# EAGLE design Single (EAGLE 7.7.0)
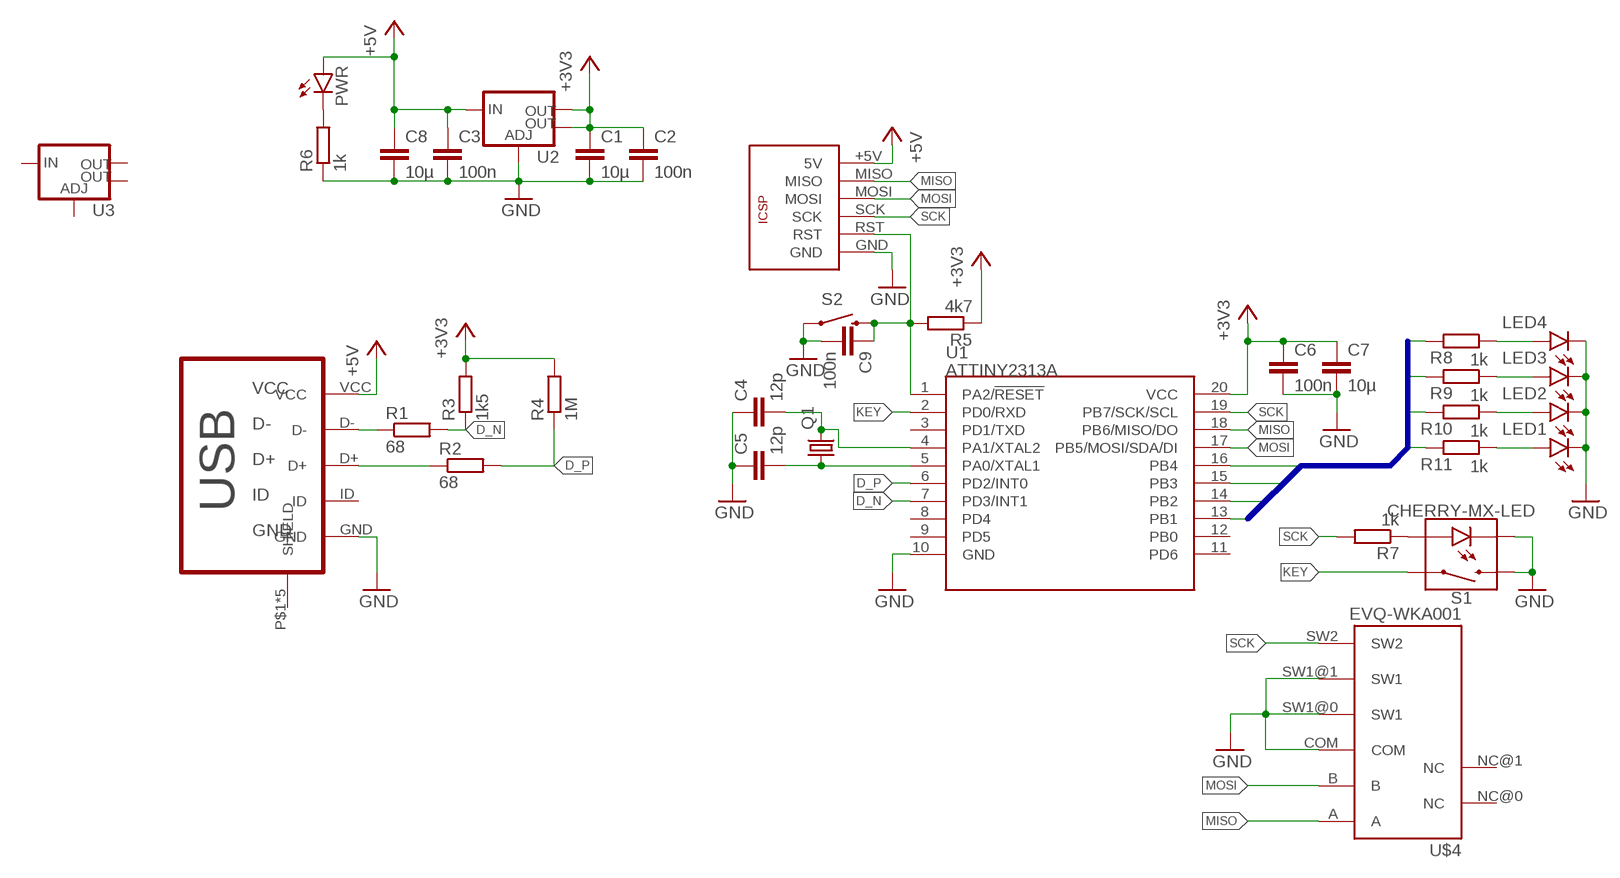
[diagram p0: schematic, sheet 1]

## Parts
C1  10µ  C-EUC0603  [C0603]
C2  100n  C-EUC0603  [C0603]
C3  100n  C-EUC0603  [C0603]
C4  12p  C-EUC0603  [C0603]
C5  12p  C-EUC0603  [C0603]
C6  100n  C-EUC0603  [C0603]
C7  10µ  C-EUC0603  [C0603]
C8  10µ  C-EUC0603  [C0603]
C9  100n  C-EUC0603  [C0603]
LED1  LED0603  [LED-0603]
LED2  LED0603  [LED-0603]
LED3  LED0603  [LED-0603]
LED4  LED0603  [LED-0603]
PWR  LED0603  [LED-0603]
Q1  CRYSTALCTS406  [CTS406]
R1  68  R-EU_R0603  [R0603]
R2  68  R-EU_R0603  [R0603]
R3  1k5  R-EU_R0603  [R0603]
R4  1M  R-EU_R0603  [R0603]
R5  4k7  R-EU_R0603  [R0603]
R6  1k  R-EU_R0603  [R0603]
R7  1k  R-EU_R0603  [R0603]
R8  1k  R-EU_R0603  [R0603]
R9  1k  R-EU_R0603  [R0603]
R10  1k  R-EU_R0603  [R0603]
R11  1k  R-EU_R0603  [R0603]
S1  CHERRY-MX-LED  [CHERRY-MX-LED]
S2  SWITCH-MOMENTARY-2SMD-1101NE  [TACTILE-SWITCH-1101NE]
U1  ATTINY2313A  [SOP20W]
U2  V_REG_LM1117SOT223  [SOT223]
U3  V_REG_LM1117SOT223  [SOT223]
U$1  ICSPTHROUGHHOLE  [ICSP-THROUGHHOLE]
U$2  MICRO-USB-B  [MICRO_USB_4_LEGS]
U$4  EVQ-WKA001  [EVQ-WKA001]

## Nets
+3V3: C1.1 C2.1 C6.1 C7.1 R3.2 R4.2 R5.1 U1.20(VCC) U2.2(OUT) U2.4(OUT)
+5V: C3.1 C8.1 PWR.A U2.3(IN) U$1.+5V(5V) U$2.VCC
D_N: R1.2 R3.1 U1.7(PD3/INT1)
D_P: R2.2 R4.1 U1.6(PD2/INT0)
DUSB_N: R1.1 U$2.D-
DUSB_P: R2.1 U$2.D+
GND: C1.2 C2.2 C3.2 C4.1 C5.1 C6.2 C7.2 C8.2 C9.2 LED1.C LED2.C LED3.C LED4.C R6.1 S1.K(C) S1.S2 S2.1 U1.10(GND) U2.1(ADJ) U$1.GND U$2.GND U$4.COM U$4.SW1@0(SW1) U$4.SW1@1(SW1)
KEY: S1.S1 U1.2(PD0/RXD)
LED1: R11.2 U1.13(PB1)
LED2: R10.2 U1.14(PB2)
LED3: R9.2 U1.15(PB3)
LED4: R8.2 U1.16(PB4)
MISO: U1.18(PB6/MISO/DO) U$1.MISO U$4.A
MOSI: U1.17(PB5/MOSI/SDA/DI) U$1.MOSI U$4.B
N$1: C4.2 Q1.3 U1.4(PA1/XTAL2)
N$2: C5.2 Q1.1 U1.5(PA0/XTAL1)
N$3: PWR.C R6.2
N$6: C9.1 R5.2 S2.2 U1.1(PA2/!RESET) U$1.RST
N$7: R7.1 S1.A
N$10: LED4.A R8.1
N$11: LED3.A R9.1
N$12: LED2.A R10.1
N$13: LED1.A R11.1
SCK: R7.2 U1.19(PB7/SCK/SCL) U$1.SCK U$4.SW2
Unconnected: U1.3(PD1/TXD) U1.8(PD4) U1.9(PD5) U1.11(PD6) U1.12(PB0) U3.1(ADJ) U3.2(OUT) U3.3(IN) U3.4(OUT) U$2.ID U$2.P$1(SHIELD) U$2.P$2(SHIELD) U$2.P$3(SHIELD) U$2.P$4(SHIELD) U$2.P$5(SHIELD) U$4.NC@0(NC) U$4.NC@1(NC)

## Buses
LED1,LED2,LED3,LED4

## Library data of the parts
C1-C9 = rcl:C-EU: CAPACITOR, European symbol
LED1-LED4 PWR = SparkFun-LED:LED: LEDs Standard schematic elements and footprints for 5mm, 3mm, 1206, and 0603 sized LEDs. 5mm - Spark Fun Electronics SKU : COM-00529 (and others)
Q1 = crystal:CRYSTAL: CRYSTAL; OC_FARNELL: unknown; OC_NEWARK: unknown
R1-R11 = rcl:R-EU_: RESISTOR, European symbol
S1 = SparkFun-Electromechanical:CHERRY-MX-LED: Cherry MX Switch - Electromechanical Swith w/ LED Cherry MX Keyswitches are top-of-the-line mechanical keyboard switches. They’re satisfyingly “clicky”, reliable up to tens-of-millions of key presses, and a standard in gaming and programming keyboards across the globe. This ‘blue’ version Cherry MX Switch is favored by most due to its secondary internal actuator making it less likely to “double-tap.” If you are looking for a noticeably audible and high-quality key switch, this is the perfect option for you! SparkFun Product Link <https://www.sparkfun.com/products/13834>; SF_ID: COM-13834
S2 = SparkFun-Electromechanical:SWITCH-MOMENTARY-2: Various NO switches- pushbuttons, reed, etc; PROD_ID: SWCH-00815
U1 = SparkFun-DigitalIC:ATTINY2313A: ATTINY2313A 2kB 20MHz I2C/SPI/UART; PROD_ID: IC-11305
U2 U3 = SparkFun-PowerIC:V_REG_LM1117: Voltage Regulator LM1117 Standard adjustable voltage regulator but in SMD form. Spark Fun Electronics SKU : COM-00595; PROD_ID: VREG-08170
U$1 = OwnStuff:ICSP
U$2 = micro usb B - 4LEGS:MICRO-USB-B
U$4 = EVQ-WKA001:EVQ-WKA001

## Board
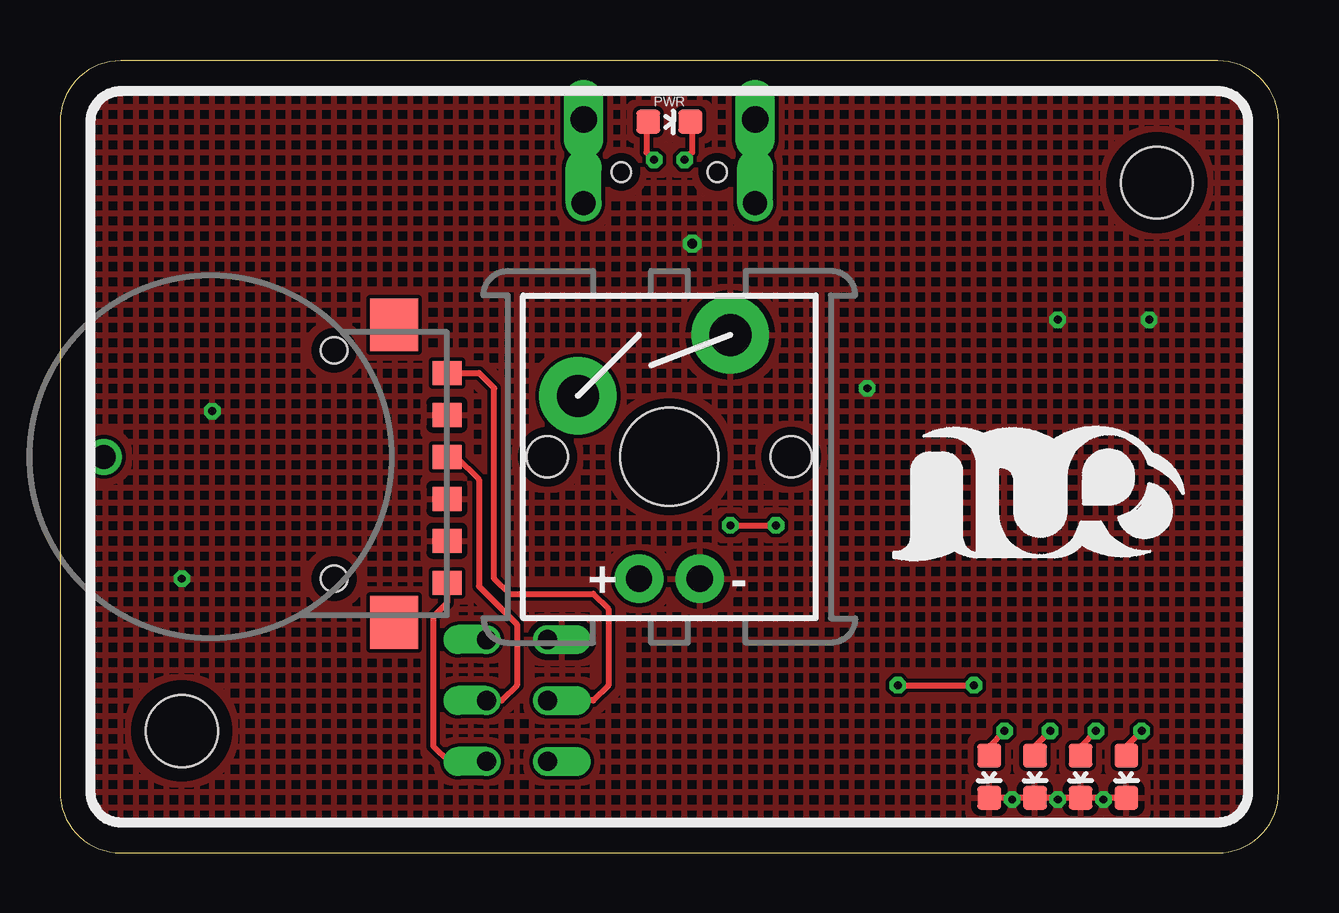
[diagram p1: board, top side]
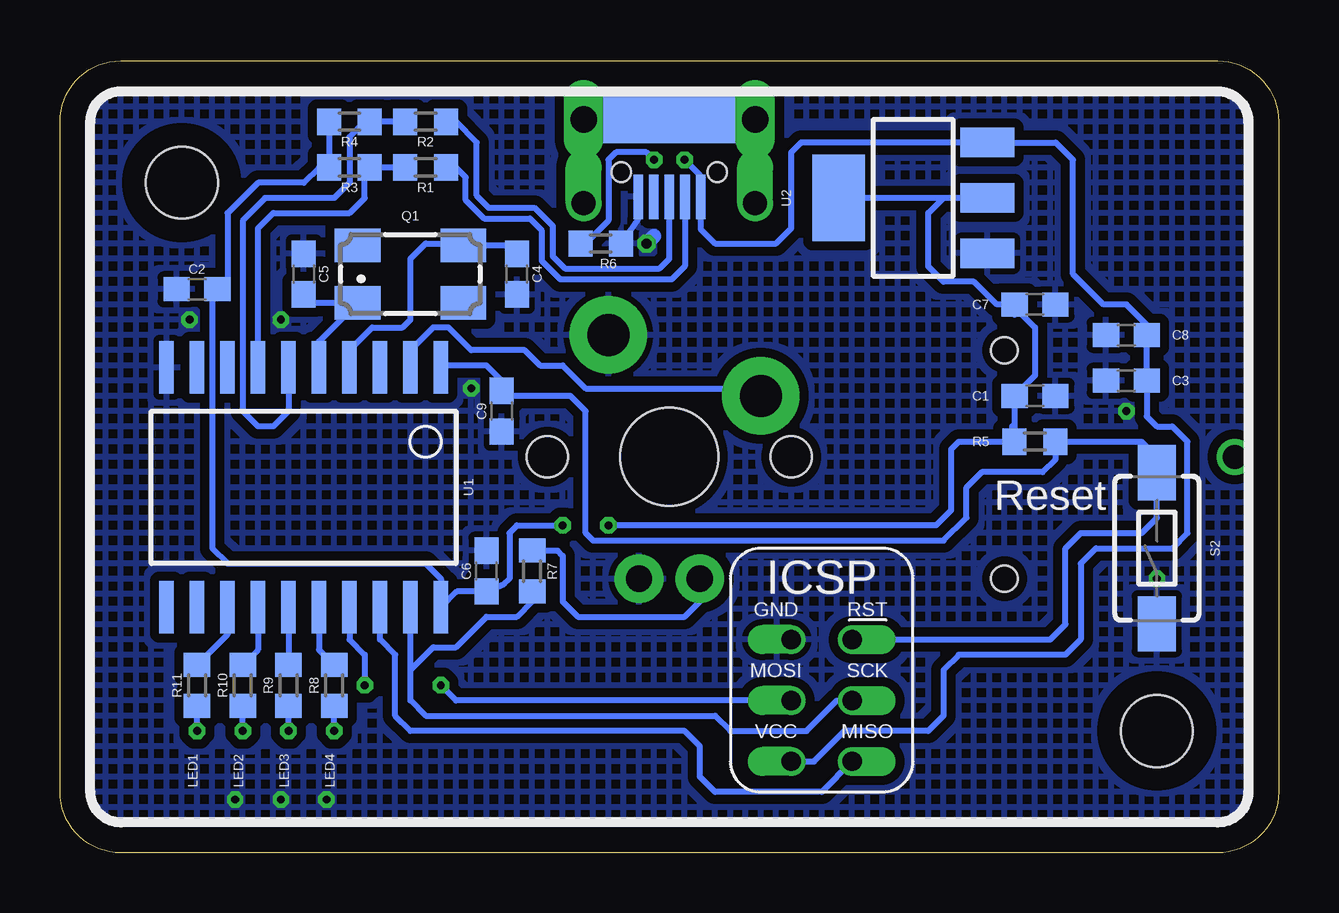
[diagram p2: board, bottom side, seen from below]

Size 50.8 x 33.02 mm. Coordinates in mm from the lower left corner, seen from the top.
Outline: 0,2.54 arc90 2.54,0 48.26,0 arc90 50.8,2.54 50.8,30.48 arc90 48.26,33.02 2.54,33.02 arc90 0,30.48 0,2.54
Copper layers (1*16): Top 0.0356mm / dielectric 1.5011mm / Bottom 0.0356mm
Design rules "LaenPCBOrder_noSamelayerClearance *": minimum track width 6mil, minimum drill 13mil, track to track 6mil, track to pad 6mil, pad to pad 6mil, via to via 6mil, smd to smd 0mil, copper to edge 15mil, drill to drill 6mil, minimum pad ring 7mil, minimum via ring 7mil, stop-mask expansion 3mil, vias tented up to drill 16mil, thermal gap 10mil
Holes 3 mm at 5.08,5.08 45.72,27.94
tKeepout: area 3.3,3.3 to 6.9,6.9; area 43.9,26.1 to 47.5,29.7; 8 lines
bKeepout: area 3.3,3.3 to 6.9,6.9; area 43.9,26.1 to 47.5,29.7; 9 lines
tRestrict: area 43.9,26.1 to 47.5,29.7; area 3.3,3.3 to 6.9,6.9; 9 lines
bRestrict: area 3.3,3.3 to 6.9,6.9; area 43.9,26.1 to 47.5,29.7; 8 lines

### Footprints (pad centres in the part's own frame; a part is rotated, then mirrored left to right if it is on the bottom)
C0603 = smd 1.1 x 1: 1 -0.85,0; 2 0.85,0
LED-0603 = smd 1 x 1: A 0,-0.877; C 0,0.877
CTS406 = smd 1.9 x 1.4: 1 -2.2,-1.2; 2 2.2,-1.2; 3 2.2,1.2; 4 -2.2,1.2
R0603 = smd 1 x 1.1: 1 -0.85,0; 2 0.85,0
CHERRY-MX-LED = drill 1.092 pad 2.032: A -1.27,-5.08; K 1.27,-5.08 | drill 1.753 pad 3.226: S1 -3.81,2.54; S2 2.54,5.08 | hole 4.089: 0,0 | hole 1.707: -5.08,0; 5.08,0
TACTILE-SWITCH-1101NE = smd 2.3 x 1.6: 1 -3.15,0; 2 3.15,0
SOP20W = smd 0.6 x 2.2: 1 -5.715,-5; 2 -4.445,-5; 3 -3.175,-5; 4 -1.905,-5; 5 -0.635,-5; 6 0.635,-5; 7 1.905,-5; 8 3.175,-5; 9 4.445,-5; 10 5.715,-5; 11 5.715,5; 12 4.445,5; 13 3.175,5; 14 1.905,5; 15 0.635,5; 16 -0.635,5; 17 -1.905,5; 18 -3.175,5; 19 -4.445,5; 20 -5.715,5
SOT223 = smd 1.219 x 2.235: 1 -2.311,-3.099; 2 0,-3.099; 3 2.311,-3.099 | smd 3.6 x 2.2: 4 0,3.099
ICSP-THROUGHHOLE = drill 0.8 offset: +5V 1.27,2.54; GND 1.27,-2.54; MISO -1.27,2.54; MOSI 1.27,0; RST -1.27,-2.54; SCK -1.27,0
MICRO_USB_4_LEGS = smd 1.85 x 0.4: D+ 3.125,0; D- 3.125,0.65; GND 3.125,-1.3; ID 3.125,-0.65; VCC 3.125,1.3 | drill 1.1 pad 1.5 long: P$1 -0.1,3.575; P$2 -0.1,-3.575 | drill 1 pad 1.5 offset: P$3 3.4,3.575; P$5 3.4,-3.575 | smd 2 x 6: P$4 -0.1,0 | hole 0.8: 2.1,2; 2.1,-2
EVQ-WKA001 = smd 1 x 1.2: A -5.25,-4.7; B 3.5,-4.7; COM -3.5,-4.7; SW1@0 1.75,-4.7; SW1@1 -1.75,-4.7; SW2 0,-4.7 | smd 2.2 x 2: NC@0 5.5,-2.5; NC@1 -6.9,-2.5 | drill 1: P$11 0,9.6 | hole 1.1: -5.08,0; 4.445,0

### Placement (x,y rotation side)
C1  10.16,19.05 0 bottom
C2  45.09,23.5 180 bottom
C3  6.35,19.68 180 bottom
C4  31.75,24.13 90 bottom
C5  40.64,24.13 270 bottom
C6  33.02,11.75 90 bottom
C7  10.16,22.86 0 bottom
C8  6.35,21.59 180 bottom
C9  32.38,18.41 270 bottom
LED1  44.45,3.17 180 top
LED2  42.55,3.17 180 top
LED3  40.64,3.17 180 top
LED4  38.73,3.17 180 top
PWR  25.4,30.48 270 top
Q1  36.2,24.13 0 bottom
R1  35.56,28.57 180 bottom
R2  35.56,30.48 180 bottom
R3  38.73,28.57 180 bottom
R4  38.73,30.48 180 bottom
R5  10.16,17.14 0 bottom
R6  28.26,25.4 180 bottom
R7  31.11,11.75 270 bottom
R8  39.37,6.99 90 bottom
R9  41.27,6.99 90 bottom
R10  43.18,6.99 90 bottom
R11  45.09,6.99 90 bottom
S1  25.4,16.51 0 top
S2  5.08,12.7 90 bottom
U1  40.64,15.24 180 bottom
U2  15.24,27.3 90 bottom
U3  1.27,-22.86 0 top  (outside the outline)
U$1  19.05,6.35 180 bottom
U$2  25.4,30.48 270 bottom
U$3  [LOGO-SILKSCREEN]  40.64,13.97 0 top
U$4  11.43,16.51 90 top

### Tracks (layer width: path | path; a pad name or v marks a point on that pad's centre or on a via)
+3V3  (via drill 0.33)
  Top 0.254: v27.94,13.65 v29.84,13.65
  Bottom 0.254: 12.06,27.3 U2.2 13.97,27.3 | R5.1 C1.1 10.16,19.9 10.16,21.91 11.01,22.76 C7.1 | R4.2 R3.2 40.01,28.57 40.64,27.94 42.55,27.94 43.81,26.67 43.81,23.91 C2.1 44.23,23.71 44.45,23.5 44.45,12.7 43.81,12.06 35.56,12.06 34.92,11.43 U1.20 34.27,10.9 C6.1 32.28,11.21 32.07,11.43 32.07,13.34 31.75,13.65 v29.84,13.65 | R5.1 11.11,17.78 | 11.11,17.68 R5.1 | v27.94,13.65 14.29,13.65 13.65,14.29 13.65,16.83 13.34,17.14 R5.1 | 10.79,16.83 10.79,17.57 R5.1 | 13.97,27.3 U2.4 | 13.97,27.3 14.61,26.67 14.61,24.45 13.97,23.81 12.7,23.81 11.75,22.86 C7.1 | C7.1 11.01,22.44
+5V  (via drill 0.33)
  Top 0.254: 24.52,29.13 v24.77,28.89 24.45,29.21 24.45,30.4 PWR.A
  Bottom 0.254: U$1.+5V 19.37,3.81 18.1,5.08 14.61,5.08 13.97,5.71 13.97,7.62 13.34,8.26 8.89,8.26 8.26,8.89 8.26,12.06 7.62,12.7 4.45,12.7 3.81,13.34 3.81,17.14 4.45,17.78 5.08,17.78 5.5,18.2 C3.1 C8.1 5.5,22.01 6.35,22.86 7.3,22.86 8.57,24.13 8.57,28.89 9.3,29.62 U2.3 19.91,29.62 20.32,29.21 20.32,26.04 20.95,25.4 23.5,25.4 24.1,26 U$2.VCC 24.13,27.39 24.13,28.26 v24.77,28.89
D_N
  Bottom 0.254: R1.2 R3.1 38.1,28.36 38.1,27.3 38.73,26.67 41.91,26.67 42.55,26.04 U1.7
D_P
  Bottom 0.254: R2.2 R4.1 38.1,30.06 38.1,30.48 38.73,29.84 38.73,27.94 39.37,27.3 42.25,27.3 43.18,26.35 43.18,18.41 42.55,17.78 41.91,17.78 41.27,18.41 U1.6
DUSB_N
  Bottom 0.254: U$2.D- 24.75,24.46 25.3,23.9 29.94,23.9 30.71,24.67 30.71,25.94 31.21,26.44 33.12,26.44 33.88,27.21 33.88,28.17 34.29,28.57 R1.1 34.94,28.35 34.38,28.98
DUSB_P
  Bottom 0.254: U$2.D+ 25.4,24.77 25.81,24.36 29.75,24.36 30.25,24.86 30.25,26.13 30.32,26.2 30.64,26.51 31.02,26.9 32.92,26.9 33.43,27.4 33.43,29.62 34.29,30.48 R2.1
GND  (via drill 0.33, 0.41)
  Top 0.254: LED1.C LED2.C 41.91,2.3 | 41.91,2.3 LED3.C LED4.C | v41.59,2.22 41.83,2.22 41.91,2.3
  Bottom 0.254: U$2.GND 26.7,26.43 R6.1
  Bottom 0.61: v26.35,25.4 26.04,25.72
  other vias: 39.69,2.22 43.5,2.22 5.08,11.43 6.35,18.41 41.59,22.23 45.4,22.23 33.66,19.37
  pour Bottom (isolate 0.381, hatched): 1.27,30.48 arc-90 2.54,31.75 48.26,31.75 arc-90 49.53,30.48 49.53,2.54 arc-90 48.26,1.27 2.54,1.27 arc-90 1.27,2.54
  pour Top (hatched): 1.27,30.48 arc-90 2.54,31.75 48.26,31.75 arc-90 49.53,30.48 49.53,2.54 arc-90 48.26,1.27 2.54,1.27 arc-90 1.27,2.54
KEY
  Bottom 0.254: U1.2 36.2,20.95 35.24,21.91 34.61,21.91 33.66,20.95 31.43,20.95 30.8,20.32 29.84,20.32 28.89,19.37 21.91,19.37 S1.S1
LED1
  Bottom 0.254: U1.13 43.81,9.11 R11.2
LED2
  Bottom 0.254: U1.14 42.55,8.47 R10.2
LED3
  Bottom 0.254: U1.15 R9.2
LED4
  Bottom 0.254: U1.16 40.01,8.47 R8.2
MISO
  Top 0.254: U$4.A 16.13,10.41 15.56,9.84 15.56,4.45 16.19,3.81 U$1.MISO
  Bottom 0.254: U$1.MISO 19.05,2.54 23.5,2.54 24.13,3.17 24.13,4.45 24.77,5.08 36.2,5.08 36.83,5.71 36.83,8.26 37.47,8.89 U1.18
MOSI  (via drill 0.33)
  Top 0.254: v34.92,6.99 v38.1,6.99 | U$4.B 17.46,20.01 18.1,19.38 18.1,11.43 18.73,10.79 22.23,10.79 22.86,10.16 22.86,6.99 22.23,6.35 U$1.MOSI
  Bottom 0.254: U$1.MOSI 34.29,6.35 v34.92,6.99 | U1.17 38.73,8.89 38.1,8.26 v38.1,6.99
N$1
  Bottom 0.254: U1.4 38.73,20.95 37.78,21.91 36.51,21.91 36.2,22.23 36.2,24.77 35.56,25.4 34.06,25.4 Q1.3 32.1,25.33 C4.2
N$2
  Bottom 0.254: U1.5 40.01,21.32 Q1.1 40.29,22.93 C5.2
N$3  (via drill 0.33)
  Top 0.254: PWR.C 26.35,30.4 26.35,29.21 v26.04,28.89
  Bottom 0.254: v26.04,28.89 26.35,29.21 27.62,29.21 27.94,28.89 27.94,26.35 28.89,25.4 R6.2
N$6
  Bottom 0.254: 5.11,15.88 S2.2 | U$1.RST 9.53,8.89 8.89,9.53 8.89,12.7 8.26,13.34 5.71,13.34 5.08,13.97 S2.2 | R5.2 5.71,17.14 5.08,16.51 S2.2 | U1.1 34.84,20.32 33.02,20.32 32.38,19.68 C9.1 32.17,19.05 29.53,19.05 28.89,18.41 28.89,13.34 28.57,13.02 13.97,13.02 13.02,13.97 13.02,15.24 12.38,15.88 9.84,15.88 9.31,16.41 R5.2 | R5.2 9.21,17.04 9.21,17.14 R5.2 | 9.31,17.04 R5.2
N$7
  Bottom 0.254: R7.1 30.06,12.6 29.84,12.38 29.84,10.48 29.21,9.84 24.77,9.84 24.13,10.48 S1.A
N$10  (via drill 0.33)
  Top 0.254: LED4.A 38.73,4.45 v39.37,5.08
  Bottom 0.254: v39.37,5.08 R8.1
N$11  (via drill 0.33)
  Top 0.254: LED3.A 40.64,4.45 v41.27,5.08
  Bottom 0.254: v41.27,5.08 R9.1
N$12  (via drill 0.33)
  Top 0.254: LED2.A 42.55,4.45 v43.18,5.08
  Bottom 0.254: v43.18,5.08 R10.1
N$13  (via drill 0.33)
  Top 0.254: LED1.A 44.45,4.45 v45.09,5.08
  Bottom 0.254: v45.09,5.08 R11.1
SCK
  Top 0.254: U$1.SCK 18.41,6.35 19.05,6.99 19.05,9.53 17.46,11.11 17.46,15.56 16.51,16.51 U$4.SW2
  Bottom 0.254: 36.2,7.62 36.2,6.35 35.56,5.71 23.5,5.71 22.86,5.08 19.68,5.08 18.41,6.35 U$1.SCK | 36.2,7.62 U1.19 | 36.2,7.62 35.24,8.57 34.29,8.57 33.02,9.84 31.75,9.84 31.11,10.48 R7.2

### Text on the board
bNames: Reset